# Altium schematic sheet Rotary.SchDoc
size B
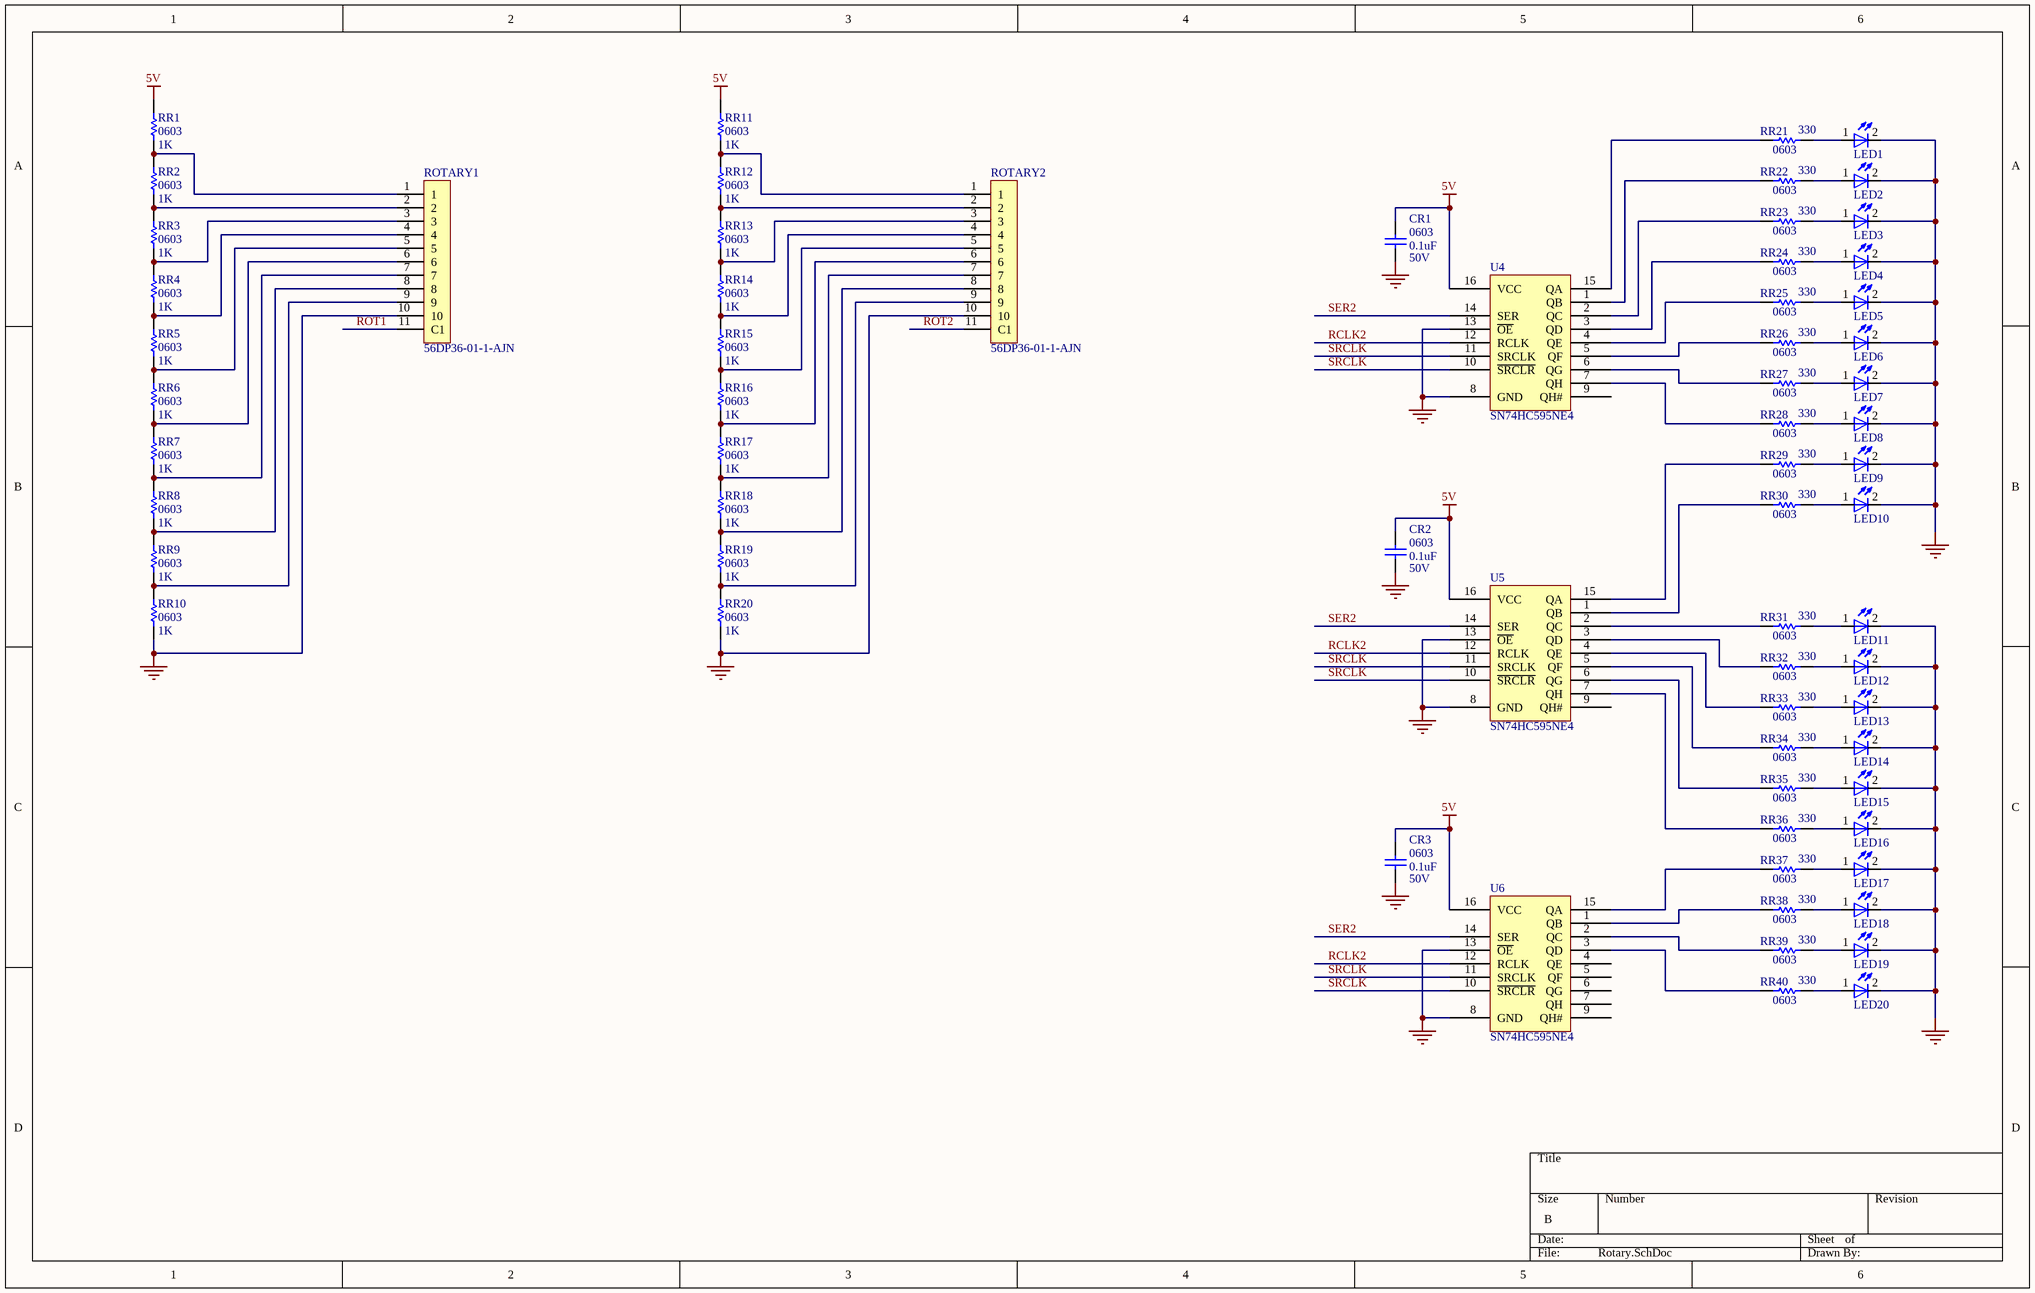
[diagram p0: Rotary.SchDoc]

## Parts
CR1  0603  value 0.1uF  Voltage Rating: 50V  [C0603]
CR2  0603  value 0.1uF  Voltage Rating: 50V  [C0603]
CR3  0603  value 0.1uF  Voltage Rating: 50V  [C0603]
LED1  LED 3mm  [LED3mm]  (value not drawn)
LED2  LED 3mm  [LED3mm]  (value not drawn)
LED3  LED 3mm  [LED3mm]  (value not drawn)
LED4  LED 3mm  [LED3mm]  (value not drawn)
LED5  LED 3mm  [LED3mm]  (value not drawn)
LED6  LED 3mm  [LED3mm]  (value not drawn)
LED7  LED 3mm  [LED3mm]  (value not drawn)
LED8  LED 3mm  [LED3mm]  (value not drawn)
LED9  LED 3mm  [LED3mm]  (value not drawn)
LED10  LED 3mm  [LED3mm]  (value not drawn)
LED11  LED 3mm  [LED3mm]  (value not drawn)
LED12  LED 3mm  [LED3mm]  (value not drawn)
LED13  LED 3mm  [LED3mm]  (value not drawn)
LED14  LED 3mm  [LED3mm]  (value not drawn)
LED15  LED 3mm  [LED3mm]  (value not drawn)
LED16  LED 3mm  [LED3mm]  (value not drawn)
LED17  LED 3mm  [LED3mm]  (value not drawn)
LED18  LED 3mm  [LED3mm]  (value not drawn)
LED19  LED 3mm  [LED3mm]  (value not drawn)
LED20  LED 3mm  [LED3mm]  (value not drawn)
ROTARY1  56DP36-01-1-AJN  [56DP36-01-1-AJN]
ROTARY2  56DP36-01-1-AJN  [56DP36-01-1-AJN]
RR1  0603  value 1K  [R0603]
RR2  0603  value 1K  [R0603]
RR3  0603  value 1K  [R0603]
RR4  0603  value 1K  [R0603]
RR5  0603  value 1K  [R0603]
RR6  0603  value 1K  [R0603]
RR7  0603  value 1K  [R0603]
RR8  0603  value 1K  [R0603]
RR9  0603  value 1K  [R0603]
RR10  0603  value 1K  [R0603]
RR11  0603  value 1K  [R0603]
RR12  0603  value 1K  [R0603]
RR13  0603  value 1K  [R0603]
RR14  0603  value 1K  [R0603]
RR15  0603  value 1K  [R0603]
RR16  0603  value 1K  [R0603]
RR17  0603  value 1K  [R0603]
RR18  0603  value 1K  [R0603]
RR19  0603  value 1K  [R0603]
RR20  0603  value 1K  [R0603]
RR21  0603  value 330  [R0603]
RR22  0603  value 330  [R0603]
RR23  0603  value 330  [R0603]
RR24  0603  value 330  [R0603]
RR25  0603  value 330  [R0603]
RR26  0603  value 330  [R0603]
RR27  0603  value 330  [R0603]
RR28  0603  value 330  [R0603]
RR29  0603  value 330  [R0603]
RR30  0603  value 330  [R0603]
RR31  0603  value 330  [R0603]
RR32  0603  value 330  [R0603]
RR33  0603  value 330  [R0603]
RR34  0603  value 330  [R0603]
RR35  0603  value 330  [R0603]
RR36  0603  value 330  [R0603]
RR37  0603  value 330  [R0603]
RR38  0603  value 330  [R0603]
RR39  0603  value 330  [R0603]
RR40  0603  value 330  [R0603]
U4  SN74HC595NE4  [DIP794W53P254L1930H508Q16N]
U5  SN74HC595NE4  [DIP794W53P254L1930H508Q16N]
U6  SN74HC595NE4  [DIP794W53P254L1930H508Q16N]

## Nets
5V: CR1.2 CR2.2 CR3.2 RR1.1 RR11.1 U4.16(VCC) U5.16(VCC) U6.16(VCC)
GND: CR1.1 CR2.1 CR3.1 LED1.2 LED2.2 LED3.2 LED4.2 LED5.2 LED6.2 LED7.2 LED8.2 LED9.2 LED10.2 LED11.2 LED12.2 LED13.2 LED14.2 LED15.2 LED16.2 LED17.2 LED18.2 LED19.2 LED20.2 ROTARY1.10 ROTARY2.10 RR10.2 RR20.2 U4.8(GND) U4.13(~{OE}) U5.8(GND) U5.13(~{OE}) U6.8(GND) U6.13(~{OE})
RCLK2: U4.12(RCLK) U5.12(RCLK) U6.12(RCLK)
ROT1: ROTARY1.11(C1)
ROT2: ROTARY2.11(C1)
~{SRCLK}: U4.10(~{SRCLR}) U5.10(~{SRCLR}) U6.10(~{SRCLR})
SER2: U4.14(SER) U5.14(SER) U6.14(SER)
SRCLK: U4.11(SRCLK) U5.11(SRCLK) U6.11(SRCLK)
NetLED1_1: LED1.1 RR21.2
NetLED2_1: LED2.1 RR22.2
NetLED3_1: LED3.1 RR23.2
NetLED4_1: LED4.1 RR24.2
NetLED5_1: LED5.1 RR25.2
NetLED6_1: LED6.1 RR26.2
NetLED7_1: LED7.1 RR27.2
NetLED8_1: LED8.1 RR28.2
NetLED9_1: LED9.1 RR29.2
NetLED10_1: LED10.1 RR30.2
NetLED11_1: LED11.1 RR31.2
NetLED12_1: LED12.1 RR32.2
NetLED13_1: LED13.1 RR33.2
NetLED14_1: LED14.1 RR34.2
NetLED15_1: LED15.1 RR35.2
NetLED16_1: LED16.1 RR36.2
NetLED17_1: LED17.1 RR37.2
NetLED18_1: LED18.1 RR38.2
NetLED19_1: LED19.1 RR39.2
NetLED20_1: LED20.1 RR40.2
NetROTARY1_1: ROTARY1.1 RR1.2 RR2.1
NetROTARY1_2: ROTARY1.2 RR2.2 RR3.1
NetROTARY1_3: ROTARY1.3 RR3.2 RR4.1
NetROTARY1_4: ROTARY1.4 RR4.2 RR5.1
NetROTARY1_5: ROTARY1.5 RR5.2 RR6.1
NetROTARY1_6: ROTARY1.6 RR6.2 RR7.1
NetROTARY1_7: ROTARY1.7 RR7.2 RR8.1
NetROTARY1_8: ROTARY1.8 RR8.2 RR9.1
NetROTARY1_9: ROTARY1.9 RR9.2 RR10.1
NetROTARY2_1: ROTARY2.1 RR11.2 RR12.1
NetROTARY2_2: ROTARY2.2 RR12.2 RR13.1
NetROTARY2_3: ROTARY2.3 RR13.2 RR14.1
NetROTARY2_4: ROTARY2.4 RR14.2 RR15.1
NetROTARY2_5: ROTARY2.5 RR15.2 RR16.1
NetROTARY2_6: ROTARY2.6 RR16.2 RR17.1
NetROTARY2_7: ROTARY2.7 RR17.2 RR18.1
NetROTARY2_8: ROTARY2.8 RR18.2 RR19.1
NetROTARY2_9: ROTARY2.9 RR19.2 RR20.1
NetRR21_1: RR21.1 U4.15(QA)
NetRR22_1: RR22.1 U4.1(QB)
NetRR23_1: RR23.1 U4.2(QC)
NetRR24_1: RR24.1 U4.3(QD)
NetRR25_1: RR25.1 U4.4(QE)
NetRR26_1: RR26.1 U4.5(QF)
NetRR27_1: RR27.1 U4.6(QG)
NetRR28_1: RR28.1 U4.7(QH)
NetRR29_1: RR29.1 U5.15(QA)
NetRR30_1: RR30.1 U5.1(QB)
NetRR31_1: RR31.1 U5.2(QC)
NetRR32_1: RR32.1 U5.3(QD)
NetRR33_1: RR33.1 U5.4(QE)
NetRR34_1: RR34.1 U5.5(QF)
NetRR35_1: RR35.1 U5.6(QG)
NetRR36_1: RR36.1 U5.7(QH)
NetRR37_1: RR37.1 U6.15(QA)
NetRR38_1: RR38.1 U6.1(QB)
NetRR39_1: RR39.1 U6.2(QC)
NetRR40_1: RR40.1 U6.3(QD)

Not connected (* = marked no-connect by the designer): U4 9(QH#); U5 9(QH#); U6 4(QE) 5(QF) 6(QG) 7(QH) 9(QH#)

## Library data of the parts
CR1-CR3 = Cap: CAP CER 0.1UF 50V X5R 0603; Manufacturer 1: Yageo; Manufacturer Part Number 1: CC0603KRX5R9BB104; Capacitance: 100nF; Tolerance: 10%; ComponentLink1URL: https://datasheet.ciiva.com/30062/tmk212bbj106kg-t-30062083.pdf?src-supplier=Onlinecomponents.com; ComponentLink1Description: https://datasheet.ciiva.com/30062/tmk212bbj106kg-t-30062083.pdf?src-supplier=Onlinecomponents.com; ComponentLink2URL: https://datasheet.ciiva.com/139/mlcc-all-e-139570.pdf?src-supplier=Digi-Key; ComponentLink2Description: https://datasheet.ciiva.com/139/mlcc-all-e-139570.pdf?src-supplier=Digi-Key; ComponentLink3URL: https://datasheet.ciiva.com/139/mlcc-all-e-139571.pdf?src-supplier=Digi-Key; ComponentLink3Description: https://datasheet.ciiva.com/139/mlcc-all-e-139571.pdf?src-supplier=Digi-Key; ComponentLink4URL: https://datasheet.ciiva.com/139/mlcc-all-e-139572.pdf?src-supplier=Digi-Key; ComponentLink4Description: https://datasheet.ciiva.com/139/mlcc-all-e-139572.pdf?src-supplier=Digi-Key; ComponentLink5URL: https://datasheet.ciiva.com/7975/1481447-7975820.pdf?src-supplier=Element14; ComponentLink5Description: https://datasheet.ciiva.com/7975/1481447-7975820.pdf?src-supplier=Element14; ComponentLink6URL: https://datasheet.ciiva.com/144/mlccorderingcode-144037.pdf?src-supplier=Digi-Key; ComponentLink6Description: https://datasheet.ciiva.com/144/mlccorderingcode-144037.pdf?src-supplier=Digi-Key; ComponentLink7URL: https://datasheet.ciiva.com/8033/1489800-8033669.pdf?src-supplier=Element14; ComponentLink7Description: https://datasheet.ciiva.com/8033/1489800-8033669.pdf?src-supplier=Element14; ComponentLink8URL: https://datasheet.ciiva.com/15189/getdatasheetpartid-321421-15189125.pdf?src-supplier=Verical; ComponentLink8Description: https://datasheet.ciiva.com/15189/getdatasheetpartid-321421-15189125.pdf?src-supplier=Verical; ComponentLink9URL: https://datasheet.ciiva.com/144/mlccorderingcode-144038.pdf?src-supplier=Digi-Key; ComponentLink9Description: https://datasheet.ciiva.com/144/mlccorderingcode-144038.pdf?src-supplier=Digi-Key; ComponentLink10URL: https://datasheet.ciiva.com/28450/1489800-28450342.pdf?src-supplier=Element14; ComponentLink10Description: https://datasheet.ciiva.com/28450/1489800-28450342.pdf?src-supplier=Element14; ComponentLink11URL: https://datasheet.ciiva.com/144/mlccorderingcode-144039.pdf?src-supplier=Digi-Key; ComponentLink11Description: https://datasheet.ciiva.com/144/mlccorderingcode-144039.pdf?src-supplier=Digi-Key; ComponentLink12URL: https://datasheet.ciiva.com/8033/1489800-8033671.pdf?src-supplier=Element14; ComponentLink12Description: https://datasheet.ciiva.com/8033/1489800-8033671.pdf?src-supplier=Element14; ComponentLink13URL: http://www.farnell.com/datasheets/1872206.pdf?src-supplier=Farnell; ComponentLink13Description: http://www.farnell.com/datasheets/1872206.pdf?src-supplier=Farnell; ComponentLink14URL: http://uk.rs-online.com/webdocs/144c/0900766b8144c113.pdf?src-supplier=RSComponents; ComponentLink14Description: http://uk.rs-online.com/webdocs/144c/0900766b8144c113.pdf?src-supplier=RSComponents; ComponentLink15URL: http://www.farnell.com/datasheets/2048008.pdf?src-supplier=Farnell; ComponentLink15Description: http://www.farnell.com/datasheets/2048008.pdf?src-supplier=Farnell; ComponentLink16URL: http://www.mouser.com/ds/2/281/c02e-2905.pdf?src-supplier=Mouser; ComponentLink16Description: http://www.mouser.com/ds/2/281/c02e-2905.pdf?src-supplier=Mouser; ComponentLink17URL: http://components.arrow.com/part/dataview/0323_06361249?src-supplier=Arrow+Europe; ComponentLink17Description: http://components.arrow.com/part/dataview/0323_06361249?src-supplier=Arrow+Europe; ComponentLink18URL: https://search.murata.co.jp/Ceramy/image/img/A01X/G101/ENG/GRM155R71E104KE14-01.pdf?src-supplier=Digi-Key; ComponentLink18Description: https://search.murata.co.jp/Ceramy/image/img/A01X/G101/ENG/GRM155R71E104KE14-01.pdf?src-supplier=Digi-Key; ComponentLink19URL: http://www.farnell.com/datasheets/2048008.pdf?src-supplier=Newark; ComponentLink19Description: http://www.farnell.com/datasheets/2048008.pdf?src-supplier=Newark; ComponentLink20URL: http://psearch.en.murata.com/capacitor/product/GRM155R71E104KE14%23.pdf?src-supplier=Avnet; ComponentLink20Description: http://psearch.en.murata.com/capacitor/product/GRM155R71E104KE14%23.pdf?src-supplier=Avnet; ComponentLink21URL: http://www.farnell.com/datasheets/2048008.pdf?src-supplier=Element14; ComponentLink21Description: http://www.farnell.com/datasheets/2048008.pdf?src-supplier=Element14; Supplier 1: Digi-Key; Supplier Part Number 1: 311-4046-1-ND; Stock 1: 3816; Pricing 1: 1=0.10000, 10=0.05600, 50=0.03080, 100=0.02510, 500=0.01794, 1000=0.01410 (USD); RoHS: Yes; Mount: Surface Mount; Case/Package: 0603; Case Code (Imperial): 0603; Case Code (Metric): 1608; Weight: 7.1E-05oz; Min Operating Temperature: -55°C; Max Operating Temperature: 85°C; Packaging: Tape and Reel; Dielectric: X5R; Termination: SMD/SMT; Voltage Rating (DC): 50V; Package Quantity: 4000; Length: 0.063inch; Width: 0.031inch; Thickness: 0.035inch; Lead Free: Lead Free; Halogen Free: Halogen Free; ComponentLink22URL: http://www.mouser.com/ds/2/447/Yageo_UPY-GP_NP0_16V-to-50V_9-358835.pdf?src-supplier=Mouser; ComponentLink22Description: http://www.mouser.com/ds/2/447/Yageo_UPY-GP_NP0_16V-to-50V_9-358835.pdf?src-supplier=Mouser; ComponentLink23URL: http://www.yageo.com/documents/recent/UPY-GPHC_X5R_4V-to-50V_25.pdf?src-supplier=Digi-Key; ComponentLink23Description: http://www.yageo.com/documents/recent/UPY-GPHC_X5R_4V-to-50V_25.pdf?src-supplier=Digi-Key; ComponentLink24URL: http://www.yageo.com/exep/pages/download/literatures/ProductSelectionGuide%202014_Final_2.pdf?src-supplier=Digi-Key; ComponentLink24Description: http://www.yageo.com/exep/pages/download/literatures/ProductSelectionGuide%202014_Final_2.pdf?src-supplier=Digi-Key
LED1-LED20 = LED 3mm: LED RED DIFFUSED T-1 3/4 T/H; Manufacturer 1: Kingbright; Manufacturer Part Number 1: WP7113ID; Forward Voltage: 2V; Luminous Intensity: 45mcd; Dominant Wavelength: 625nm; Test Current: 10mA; Viewing Angle: 30°; Lens Style: Diffused,Tinted,Dome,Round; ComponentLink1URL: https://datasheet.ciiva.com/15117/getdatasheetpartid-103986-15117447.pdf?src-supplier=Verical; ComponentLink1Description: https://datasheet.ciiva.com/15117/getdatasheetpartid-103986-15117447.pdf?src-supplier=Verical; ComponentLink2URL: https://datasheet.ciiva.com/25764/ltst-c170tbkt-25764828.pdf?src-supplier=Allied+Electronics; ComponentLink2Description: https://datasheet.ciiva.com/25764/ltst-c170tbkt-25764828.pdf?src-supplier=Allied+Electronics; ComponentLink3URL: https://datasheet.ciiva.com/12400/lite-on-ltst-c170tbkt-190169-12400787.pdf?src-supplier=Mouser; ComponentLink3Description: https://datasheet.ciiva.com/12400/lite-on-ltst-c170tbkt-190169-12400787.pdf?src-supplier=Mouser; ComponentLink4URL: https://datasheet.ciiva.com/27055/1996161-27055955.pdf?src-supplier=Jameco; ComponentLink4Description: https://datasheet.ciiva.com/27055/1996161-27055955.pdf?src-supplier=Jameco; ComponentLink5URL: https://datasheet.ciiva.com/11773/0900766b80dc0281-11773879.pdf?src-supplier=RSComponents; ComponentLink5Description: https://datasheet.ciiva.com/11773/0900766b80dc0281-11773879.pdf?src-supplier=RSComponents; ComponentLink6URL: https://datasheet.ciiva.com/16199/lite-on20ltst-c170tbkt-16199611.pdf?src-supplier=Future+Electronics; ComponentLink6Description: https://datasheet.ciiva.com/16199/lite-on20ltst-c170tbkt-16199611.pdf?src-supplier=Future+Electronics; ComponentLink7URL: https://datasheet.ciiva.com/2110/s-110-ltst-c170tbkt-2110488.pdf?src-supplier=Digi-Key; ComponentLink7Description: https://datasheet.ciiva.com/2110/s-110-ltst-c170tbkt-2110488.pdf?src-supplier=Digi-Key; ComponentLink8URL: https://datasheet.ciiva.com/2110/s-110-ltst-c170tbkt-2110489.pdf?src-supplier=Digi-Key; ComponentLink8Description: https://datasheet.ciiva.com/2110/s-110-ltst-c170tbkt-2110489.pdf?src-supplier=Digi-Key; ComponentLink9URL: https://datasheet.ciiva.com/2110/s-110-ltst-c170tbkt-2110490.pdf?src-supplier=Digi-Key; ComponentLink9Description: https://datasheet.ciiva.com/2110/s-110-ltst-c170tbkt-2110490.pdf?src-supplier=Digi-Key; Supplier 1: Digi-Key; Stock 1: 100478; Pricing 1: 1=0.48000, 10=0.34200, 100=0.15200, 500=0.10640, 1000=0.08740, 2500=0.07600, 5000=0.06840, 10000=0.06080, 25000=0.05700 (USD); RoHS: Yes; Mount: Through Hole; Case/Package: Radial; Color: Red; Lens Color: Red; Illumination Color: Red; Wavelength: 625nm; Package Quantity: 1000; Packaging: Bulk; Height: 8.6mm; Lead Free: Lead Free; ComponentLink10URL: https://datasheet.ciiva.com/4692/wp7113id-48891-4692862.pdf?src-supplier=Mouser; ComponentLink10Description: https://datasheet.ciiva.com/4692/wp7113id-48891-4692862.pdf?src-supplier=Mouser; ComponentLink11URL: https://datasheet.ciiva.com/2114/wp7113id-2114384.pdf?src-supplier=Digi-Key; ComponentLink11Description: https://datasheet.ciiva.com/2114/wp7113id-2114384.pdf?src-supplier=Digi-Key; ComponentLink12URL: https://datasheet.ciiva.com/16210/wp7113id-16210118.pdf?src-supplier=Future+Electronics; ComponentLink12Description: https://datasheet.ciiva.com/16210/wp7113id-16210118.pdf?src-supplier=Future+Electronics; Supplier Part Number 1: 754-1264-ND
ROTARY1 ROTARY2 = 56DP36-01-1-AJN: Switch Rotary SP Flatted Shaft PC Pins 0.2A 115VAC 30VDC; Manufacturer 1: Grayhill; Max Current Rating: 200mA; Voltage Rating (DC): 30V; Throw Configuration: SP,SP10T; Voltage Rating (AC): 115V; Contact Resistance: 15mR; Number of Poles: 1; Contact Style: Non-Shorting; Index Angle: 36°; Illumination Type: Illuminated; Index Stops: Adjustable; Actuator Length: 9.53mm; Supplier 1: Digi-Key; Manufacturer Part Number 1: 56DP36-01-1-AJN; Stock 1: 1317; Pricing 1: 1=12.16000, 5=10.45800, 10=9.77800, 25=8.96720, 50=8.36600, 100=7.84320, 250=7.29600 (USD); RoHS: Yes; Mount: Through Hole,Panel; Number of Pins: 10; Housing Material: Plastic; Contact Material: Brass; Contact Plating: Silver; Max Voltage Rating (DC): 30V; Max Voltage Rating (AC): 115V; Contact Current Rating: 200mA; Number of Decks: 1; Number of Poles per Deck: 1; Termination: PC Pins; Orientation: Straight; Current Rating: 200mA; Actuator Type: Shaft; Diameter: 12.7mm; Length: 12.7mm; Depth: 12.7mm; REACH SVHC: No SVHC; Lead Free: Lead Free; ComponentLink1URL: https://datasheet.ciiva.com/15184/getdatasheetpartid-644553-15184288.pdf?src-supplier=Verical; ComponentLink1Description: https://datasheet.ciiva.com/15184/getdatasheetpartid-644553-15184288.pdf?src-supplier=Verical; ComponentLink2URL: https://datasheet.ciiva.com/2887/rotary-56-2887321.pdf?src-supplier=Digi-Key; ComponentLink2Description: https://datasheet.ciiva.com/2887/rotary-56-2887321.pdf?src-supplier=Digi-Key; ComponentLink3URL: https://datasheet.ciiva.com/1532/20298-1532172.pdf?src-supplier=Element14; ComponentLink3Description: https://datasheet.ciiva.com/1532/20298-1532172.pdf?src-supplier=Element14; ComponentLink4URL: https://datasheet.ciiva.com/30101/219rotary-561-30101036.pdf?src-supplier=Onlinecomponents.com; ComponentLink4Description: https://datasheet.ciiva.com/30101/219rotary-561-30101036.pdf?src-supplier=Onlinecomponents.com; Supplier Part Number 1: GH7281-ND
RR1-RR20 = Res1: RES SMD 1K OHM 1% 1/10W 0603; Manufacturer: Yageo; Manufacturer Part Number: RC0603FR-071KL; Temperature Coefficient: 100ppm/°C; Resistance: 1kR; Power Rating: 100mW; Voltage Rating: 50V; ComponentLink1URL: https://datasheet.ciiva.com/2452/pyu-r-int-thick-7-2452944.pdf?src-supplier=Digi-Key; ComponentLink1Description: https://datasheet.ciiva.com/2452/pyu-r-int-thick-7-2452944.pdf?src-supplier=Digi-Key; ComponentLink2URL: https://datasheet.ciiva.com/2452/pyu-r-int-thick-7-2452945.pdf?src-supplier=Digi-Key; ComponentLink2Description: https://datasheet.ciiva.com/2452/pyu-r-int-thick-7-2452945.pdf?src-supplier=Digi-Key; ComponentLink3URL: https://datasheet.ciiva.com/2452/pyu-r-int-thick-7-2452946.pdf?src-supplier=Digi-Key; ComponentLink3Description: https://datasheet.ciiva.com/2452/pyu-r-int-thick-7-2452946.pdf?src-supplier=Digi-Key; ComponentLink4URL: https://datasheet.ciiva.com/7746/443971-7746453.pdf?src-supplier=Element14; ComponentLink4Description: https://datasheet.ciiva.com/7746/443971-7746453.pdf?src-supplier=Element14; ComponentLink5URL: https://datasheet.ciiva.com/7746/443971-7746454.pdf?src-supplier=Element14; ComponentLink5Description: https://datasheet.ciiva.com/7746/443971-7746454.pdf?src-supplier=Element14; ComponentLink6URL: https://datasheet.ciiva.com/6063/1868787-6063175.pdf?src-supplier=Farnell; ComponentLink6Description: https://datasheet.ciiva.com/6063/1868787-6063175.pdf?src-supplier=Farnell; ComponentLink7URL: https://datasheet.ciiva.com/15189/getdatasheetpartid-329325-15189851.pdf?src-supplier=Verical; ComponentLink7Description: https://datasheet.ciiva.com/15189/getdatasheetpartid-329325-15189851.pdf?src-supplier=Verical; Supplier 1: Digi-Key; Supplier Part Number 1: 311-1.00KHRDKR-ND; Stock 1: 31104604; Pricing 1: 1=0.10000, 10=0.02300, 100=0.00940, 1000=0.00421, 2500=0.00366 (USD); RoHS: Yes; Case/Package: 0603; Contact Plating: Tin,Matte; Case Code (Imperial): 0603; Case Code (Metric): 1608; Min Operating Temperature: -55°C; Max Operating Temperature: 155°C; Composition: Thick Film; Tolerance: 1%; Packaging: Tape and Reel; Military Standard: Not; Termination: SMD/SMT; Length: 1.6mm; Height: 0.45mm; Depth: 0.8mm; Radiation Hardening: No; Lead Free: Lead Free; REACH SVHC: No SVHC; ComponentLink8URL: https://datasheet.ciiva.com/11808/0900766b80f96399-11808081.pdf?src-supplier=RSComponents; ComponentLink8Description: https://datasheet.ciiva.com/11808/0900766b80f96399-11808081.pdf?src-supplier=RSComponents; ComponentLink9URL: https://datasheet.ciiva.com/25906/pyu-rc0603-51-rohs-l-4-25906933.pdf?src-supplier=Avnet+Europe; ComponentLink9Description: https://datasheet.ciiva.com/25906/pyu-rc0603-51-rohs-l-4-25906933.pdf?src-supplier=Avnet+Europe; ComponentLink10URL: https://datasheet.ciiva.com/7660/1868787-7660790.pdf?src-supplier=Element14; ComponentLink10Description: https://datasheet.ciiva.com/7660/1868787-7660790.pdf?src-supplier=Element14; ComponentLink11URL: https://datasheet.ciiva.com/7746/1738695-7746279.pdf?src-supplier=Element14; ComponentLink11Description: https://datasheet.ciiva.com/7746/1738695-7746279.pdf?src-supplier=Element14; ComponentLink12URL: https://datasheet.ciiva.com/7746/1686128-7746280.pdf?src-supplier=Element14; ComponentLink12Description: https://datasheet.ciiva.com/7746/1686128-7746280.pdf?src-supplier=Element14; ComponentLink13URL: https://datasheet.ciiva.com/28386/pyu-rc0603-51-rohs-l-4-28386648.pdf?src-supplier=Avnet+Europe; ComponentLink13Description: https://datasheet.ciiva.com/28386/pyu-rc0603-51-rohs-l-4-28386648.pdf?src-supplier=Avnet+Europe; ComponentLink14URL: https://datasheet.ciiva.com/7746/1738695-7746281.pdf?src-supplier=Element14; ComponentLink14Description: https://datasheet.ciiva.com/7746/1738695-7746281.pdf?src-supplier=Element14; ComponentLink15URL: https://datasheet.ciiva.com/8896/pyu-rc0603-51-rohs-l-4-8896106.pdf?src-supplier=Avnet; ComponentLink15Description: https://datasheet.ciiva.com/8896/pyu-rc0603-51-rohs-l-4-8896106.pdf?src-supplier=Avnet; ComponentLink16URL: https://datasheet.ciiva.com/15189/getdatasheetpartid-404327-15189644.pdf?src-supplier=Verical; ComponentLink16Description: https://datasheet.ciiva.com/15189/getdatasheetpartid-404327-15189644.pdf?src-supplier=Verical; ComponentLink17URL: https://datasheet.ciiva.com/7983/443971-7983613.pdf?src-supplier=Element14; ComponentLink17Description: https://datasheet.ciiva.com/7983/443971-7983613.pdf?src-supplier=Element14
RR21-RR40 = Res1: RES SMD 330 OHM 1% 1/10W 0603; Manufacturer 1: Yageo; Manufacturer Part Number 1: RC0603FR-07330RL; Max Power Dissipation: 100mW; Temperature Coefficient: 100ppm/°C; Voltage Rating (DC): 50V; Resistance: 330R; ComponentLink1URL: https://datasheet.ciiva.com/11819/0900766b80c66297-11819490.pdf?src-supplier=RSComponents; ComponentLink1Description: https://datasheet.ciiva.com/11819/0900766b80c66297-11819490.pdf?src-supplier=RSComponents; ComponentLink2URL: https://datasheet.ciiva.com/7849/1018594-7849962.pdf?src-supplier=Element14; ComponentLink2Description: https://datasheet.ciiva.com/7849/1018594-7849962.pdf?src-supplier=Element14; ComponentLink3URL: https://datasheet.ciiva.com/17083/pyu-rc0402-51-rohs-l-6-r-17083994.pdf?src-supplier=Future+Electronics; ComponentLink3Description: https://datasheet.ciiva.com/17083/pyu-rc0402-51-rohs-l-6-r-17083994.pdf?src-supplier=Future+Electronics; ComponentLink4URL: https://datasheet.ciiva.com/7849/1018594-7849963.pdf?src-supplier=Element14; ComponentLink4Description: https://datasheet.ciiva.com/7849/1018594-7849963.pdf?src-supplier=Element14; ComponentLink5URL: https://datasheet.ciiva.com/2453/pyu-r-int-thick-7-2453661.pdf?src-supplier=Digi-Key; ComponentLink5Description: https://datasheet.ciiva.com/2453/pyu-r-int-thick-7-2453661.pdf?src-supplier=Digi-Key; ComponentLink6URL: https://datasheet.ciiva.com/2453/pyu-r-int-thick-7-2453662.pdf?src-supplier=Digi-Key; ComponentLink6Description: https://datasheet.ciiva.com/2453/pyu-r-int-thick-7-2453662.pdf?src-supplier=Digi-Key; ComponentLink7URL: https://datasheet.ciiva.com/2453/pyu-r-int-thick-7-2453663.pdf?src-supplier=Digi-Key; ComponentLink7Description: https://datasheet.ciiva.com/2453/pyu-r-int-thick-7-2453663.pdf?src-supplier=Digi-Key; ComponentLink8URL: https://datasheet.ciiva.com/12656/pyu-rc0402-51-rohs-l-6-r-12656815.pdf?src-supplier=Mouser; ComponentLink8Description: https://datasheet.ciiva.com/12656/pyu-rc0402-51-rohs-l-6-r-12656815.pdf?src-supplier=Mouser; Supplier 1: Digi-Key; Supplier Part Number 1: 311-330HRCT-ND; Stock 1: 3885547; Pricing 1: 1=0.10000, 10=0.02300, 100=0.00940, 1000=0.00421, 2500=0.00366 (USD); RoHS: Yes; Case/Package: 0603; Number of Pins: 2; Case Code (Metric): 1608; Case Code (Imperial): 0603; Min Operating Temperature: -55°C; Max Operating Temperature: 155°C; Composition: Thick Film; Features: Moisture Resistant; Number of Terminations: 2; Termination: SMD/SMT; Power Rating: 100mW; Tolerance: 1%; Voltage Rating: 50V; Packaging: Tape and Reel; Package Quantity: 1; Length: 1.6mm; Height: 0.45mm; Depth: 0.8mm; Width: 0.8mm; Lead Free: Lead Free; REACH SVHC: No SVHC; ComponentLink9URL: https://datasheet.ciiva.com/11819/0900766b80f96399-11819327.pdf?src-supplier=RSComponents; ComponentLink9Description: https://datasheet.ciiva.com/11819/0900766b80f96399-11819327.pdf?src-supplier=RSComponents; ComponentLink10URL: https://datasheet.ciiva.com/2454/pyu-r-int-thick-7-2454864.pdf?src-supplier=Digi-Key; ComponentLink10Description: https://datasheet.ciiva.com/2454/pyu-r-int-thick-7-2454864.pdf?src-supplier=Digi-Key; ComponentLink11URL: https://datasheet.ciiva.com/2454/pyu-r-int-thick-7-2454865.pdf?src-supplier=Digi-Key; ComponentLink11Description: https://datasheet.ciiva.com/2454/pyu-r-int-thick-7-2454865.pdf?src-supplier=Digi-Key; ComponentLink12URL: https://datasheet.ciiva.com/2454/pyu-r-int-thick-7-2454866.pdf?src-supplier=Digi-Key; ComponentLink12Description: https://datasheet.ciiva.com/2454/pyu-r-int-thick-7-2454866.pdf?src-supplier=Digi-Key; ComponentLink13URL: https://datasheet.ciiva.com/12555/rc0603-272842-12555334.pdf?src-supplier=Mouser; ComponentLink13Description: https://datasheet.ciiva.com/12555/rc0603-272842-12555334.pdf?src-supplier=Mouser; ComponentLink14URL: https://datasheet.ciiva.com/46440/1868787-46440904.pdf?src-supplier=Element14; ComponentLink14Description: https://datasheet.ciiva.com/46440/1868787-46440904.pdf?src-supplier=Element14; ComponentLink15URL: https://datasheet.ciiva.com/7746/443971-7746329.pdf?src-supplier=Element14; ComponentLink15Description: https://datasheet.ciiva.com/7746/443971-7746329.pdf?src-supplier=Element14; ComponentLink16URL: https://datasheet.ciiva.com/7746/443971-7746330.pdf?src-supplier=Element14; ComponentLink16Description: https://datasheet.ciiva.com/7746/443971-7746330.pdf?src-supplier=Element14; ComponentLink17URL: https://datasheet.ciiva.com/7746/1686128-7746331.pdf?src-supplier=Element14; ComponentLink17Description: https://datasheet.ciiva.com/7746/1686128-7746331.pdf?src-supplier=Element14
U4-U6 = SN74HC595NE4: Counter Shift Registers 8-Bit Shift Register; Manufacturer 1: Texas Instruments; Number of Circuits: 4; Number of Output Lines: 10; Number of Bits per Element: 8; Turn-On Delay Time: 250ns; Max Supply Voltage: 6V; Operating Supply Voltage: 5V; Min Supply Voltage: 2V; Number of Elements: 1; Direction: Unidirectional; Supplier 1: Digi-Key; Manufacturer Part Number 1: SN74HC595NE4; Stock 1: 1779; Pricing 1: 1=0.57000, 10=0.48800, 25=0.45520, 100=0.36400, 250=0.33800, 500=0.28600, 1000=0.22100, 2500=0.20150, 5000=0.18850 (USD); RoHS: Yes; Mount: Through Hole; Case/Package: PDIP; Number of Pins: 16; Weight: 0.03357oz; Min Operating Temperature: -40°C; Max Operating Temperature: 85°C; Number of Bits: 8; Package Quantity: 25; Packaging: Rail/Tube; Propagation Delay: 250ns; Logic Function: Shift Register; Radiation Hardening: No; Lead Free: Lead Free; ComponentLink1URL: https://datasheet.ciiva.com/15093/getdatasheetpartid-37319-15093075.pdf?src-supplier=Verical; ComponentLink1Description: https://datasheet.ciiva.com/15093/getdatasheetpartid-37319-15093075.pdf?src-supplier=Verical; ComponentLink2URL: https://datasheet.ciiva.com/18575/sn74hc595-18575023.pdf?src-supplier=Digi-Key; ComponentLink2Description: https://datasheet.ciiva.com/18575/sn74hc595-18575023.pdf?src-supplier=Digi-Key; Supplier Part Number 1: 296-36142-5-ND